# EAGLE design L1 (EAGLE 7.7.0)
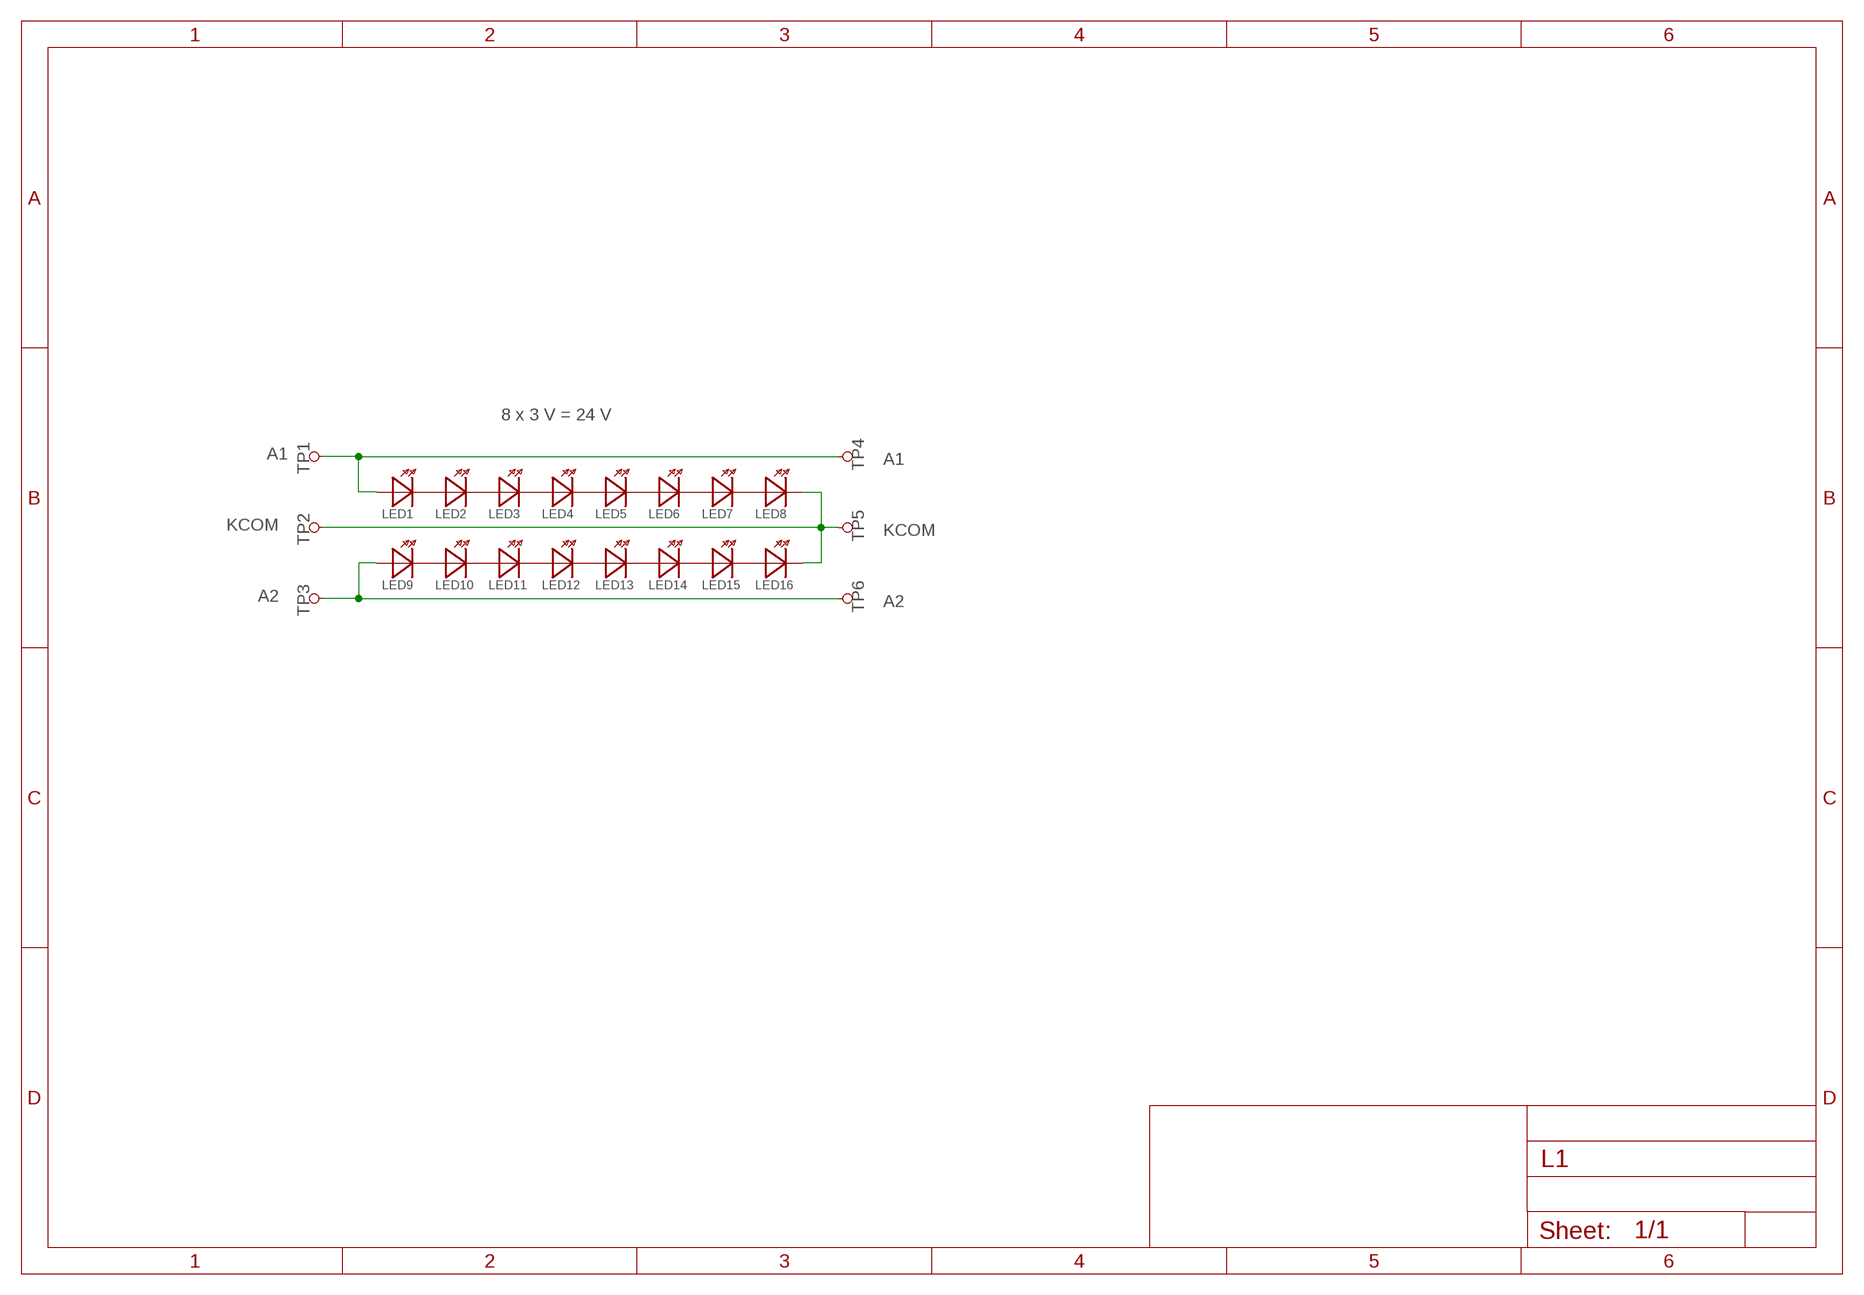
[diagram p0: schematic, sheet 1]

## Parts
LED1  LED_JE2835  [LED_JE2835]
LED2  LED_JE2835  [LED_JE2835]
LED3  LED_JE2835  [LED_JE2835]
LED4  LED_JE2835  [LED_JE2835]
LED5  LED_JE2835  [LED_JE2835]
LED6  LED_JE2835  [LED_JE2835]
LED7  LED_JE2835  [LED_JE2835]
LED8  LED_JE2835  [LED_JE2835]
LED9  LED_JE2835  [LED_JE2835]
LED10  LED_JE2835  [LED_JE2835]
LED11  LED_JE2835  [LED_JE2835]
LED12  LED_JE2835  [LED_JE2835]
LED13  LED_JE2835  [LED_JE2835]
LED14  LED_JE2835  [LED_JE2835]
LED15  LED_JE2835  [LED_JE2835]
LED16  LED_JE2835  [LED_JE2835]
TP1  A1  TP_4X2.2MM  [PAD_4X2.2MM]
TP2  KCOM  TP_4X2.2MM  [PAD_4X2.2MM]
TP3  A2  TP_4X2.2MM  [PAD_4X2.2MM]
TP4  A1  TP_4X2.2MM  [PAD_4X2.2MM]
TP5  KCOM  TP_4X2.2MM  [PAD_4X2.2MM]
TP6  A2  TP_4X2.2MM  [PAD_4X2.2MM]

## Nets
A1: LED1.1(A) TP1.1 TP4.1
A2: LED9.1(A) TP3.1 TP6.1
KCOM: LED8.2(K) LED16.2(K) TP2.1 TP5.1
N$1: LED1.2(K) LED2.1(A)
N$2: LED2.2(K) LED3.1(A)
N$3: LED3.2(K) LED4.1(A)
N$4: LED4.2(K) LED5.1(A)
N$5: LED5.2(K) LED6.1(A)
N$6: LED6.2(K) LED7.1(A)
N$7: LED7.2(K) LED8.1(A)
N$8: LED9.2(K) LED10.1(A)
N$9: LED10.2(K) LED11.1(A)
N$10: LED11.2(K) LED12.1(A)
N$11: LED12.2(K) LED13.1(A)
N$12: LED13.2(K) LED14.1(A)
N$13: LED14.2(K) LED15.1(A)
N$14: LED15.2(K) LED16.1(A)

## Notes on the sheet
- 8 x 3 V = 24 V

## Library data of the parts
LED1-LED16 = megli:LED
TP1-TP6 = megli:TP

## Board
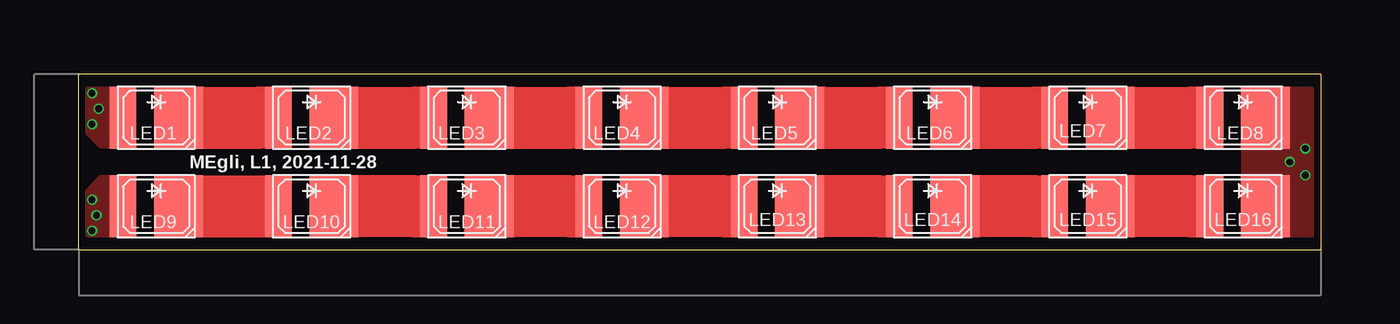
[diagram p1: board, top side]
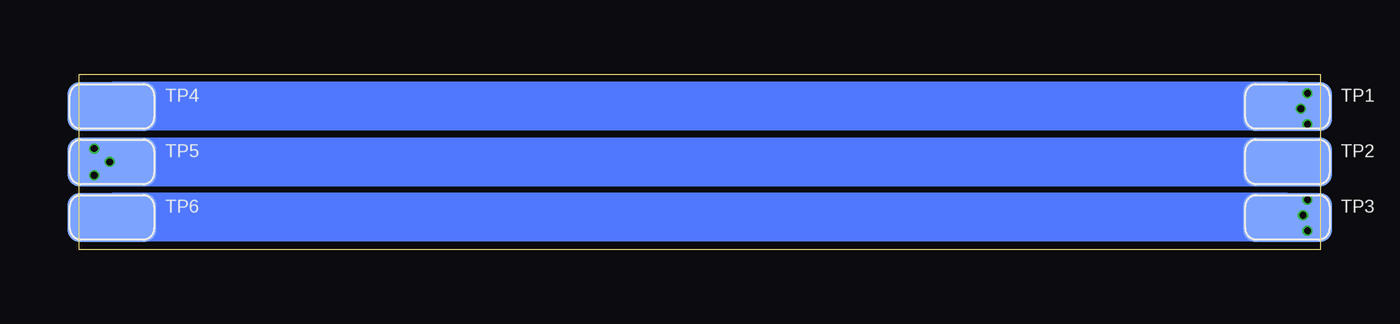
[diagram p2: board, bottom side, seen from below]

Size 56 x 7.9 mm. Coordinates in mm from the lower left corner, seen from the top.
Outline: 0,0 56,0 56,7.9 0,7.9 0,0
Copper layers (1*16): Top 0.035mm / dielectric 1.6mm / Bottom 0.035mm
Design rules "jlcpcb-2layers *": minimum track width 5mil, minimum drill 0.3mm, track to track 5mil, track to pad 5mil, pad to pad 5mil, via to via 5mil, smd to smd 5mil, copper to edge 0.2mm, drill to drill 6mil, minimum pad ring 10mil, minimum via ring 3mil, stop-mask expansion 4mil, vias tented up to drill 0.4mm, thermal gap 10mil
tRestrict: 8 lines

### Footprints (pad centres in the part's own frame; a part is rotated, then mirrored left to right if it is on the bottom)
LED_JE2835 = smd 1.2 x 2.8: 1 -1.5,0 | smd 2.2 x 2.8: 2 1,0
PAD_4X2.2MM = smd 4 x 2.2: 1 0,0

### Placement (x,y rotation side)
LED1  3.5,5.95 0 top
LED2  10.5,5.95 0 top
LED3  17.5,5.95 0 top
LED4  24.5,5.95 0 top
LED5  31.5,5.95 0 top
LED6  38.5,5.95 0 top
LED7  45.5,5.95 0 top
LED8  52.5,5.95 0 top
LED9  3.5,1.95 0 top
LED10  10.5,1.95 0 top
LED11  17.5,1.95 0 top
LED12  24.5,1.95 0 top
LED13  31.5,1.95 0 top
LED14  38.5,1.95 0 top
LED15  45.5,1.95 0 top
LED16  52.5,1.95 0 top
TP1  1.5,6.45 0 bottom
TP2  1.5,3.95 0 bottom
TP3  1.5,1.45 0 bottom
TP4  54.5,6.45 0 bottom
TP5  54.5,3.95 0 bottom
TP6  54.5,1.45 0 bottom

### Tracks (layer width: path | path; a pad name or v marks a point on that pad's centre or on a via)
A1  (via drill 0.3)
  Bottom 0.2: TP1.1 0.7,6.45
  Bottom 1: 0.7,6.45 0.9,6.45 v0.9,6.35
  Bottom 2.2: TP1.1 TP4.1
  other vias: 0.6,5.65 0.6,7.05
  pour Top (no thermals): 2.5,7.25 0.4,7.25 0.4,5.25 1,4.65 2.5,4.65
A2  (via drill 0.3)
  Bottom 0.2: TP3.1 0.7,1.45
  Bottom 1: 0.7,1.45 0.8,1.45 v0.8,1.55
  Bottom 2.2: TP3.1 TP6.1
  other vias: 0.6,2.25 0.6,0.85
  pour Top (no thermals): 2.5,3.25 2.5,0.65 0.4,0.65 0.4,2.65 1,3.25
KCOM  (via drill 0.3)
  Bottom 0.2: TP5.1 55.3,3.95 v55.3,4.55
  Bottom 2.2: TP5.1 TP2.1
  other vias: 55.3,3.35 54.6,3.95
  pour Top (no thermals): 52.5,7.25 52.5,0.65 55.6,0.65 55.6,7.25
N$1
  Top 1: LED1.2 5.3,5.95 | 8.2,5.95 LED2.1
  Top 2.8: 5.3,5.95 8.2,5.95
N$2
  Top 1: LED2.2 12.1,5.95 | 15.2,5.95 LED3.1
  Top 2.8: 12.1,5.95 15.2,5.95
N$3
  Top 1: LED3.2 19.5,5.95 | 22.2,5.95 LED4.1
  Top 2.8: 19.5,5.95 22.2,5.95
N$4
  Top 1: LED4.2 26.2,5.95 | 29.2,5.95 LED5.1
  Top 2.8: 26.2,5.95 29.2,5.95
N$5
  Top 1: LED5.2 33.5,5.95 | 36.2,5.95 LED6.1
  Top 2.8: 33.5,5.95 36.2,5.95
N$6
  Top 1: LED6.2 40,5.95 | 43.2,5.95 LED7.1
  Top 2.8: 40,5.95 43.2,5.95
N$7
  Top 1: LED7.2 47.1,5.95 | 50.2,5.95 LED8.1
  Top 2.8: 47.1,5.95 50.2,5.95
N$8
  Top 1: LED9.2 4.8,1.95 | 8.2,1.95 LED10.1
  Top 2.8: 4.8,1.95 8.2,1.95
N$9
  Top 1: LED11.1 15.2,1.95 | 12.2,1.95 LED10.2
  Top 2.8: 15.2,1.95 12.2,1.95
N$10
  Top 1: LED12.1 22.2,1.95 | 19.5,1.95 LED11.2
  Top 2.8: 22.2,1.95 19.5,1.95
N$11
  Top 1: LED13.1 29.2,1.95 | 26.4,1.95 LED12.2
  Top 2.8: 29.2,1.95 26.4,1.95
N$12
  Top 1: LED14.1 36.2,1.95 | 33.3,1.95 LED13.2
  Top 2.8: 36.2,1.95 33.3,1.95
N$13
  Top 1: LED15.1 43.2,1.95 | 40.1,1.95 LED14.2
  Top 2.8: 43.2,1.95 40.1,1.95
N$14
  Top 1: LED16.1 50.2,1.95 | 47.1,1.95 LED15.2
  Top 2.8: 50.2,1.95 47.1,1.95

### Text on the board
tPlace: MEgli, L1, 2021-11-28